# Altium project Pre-Amp.PrjPcb
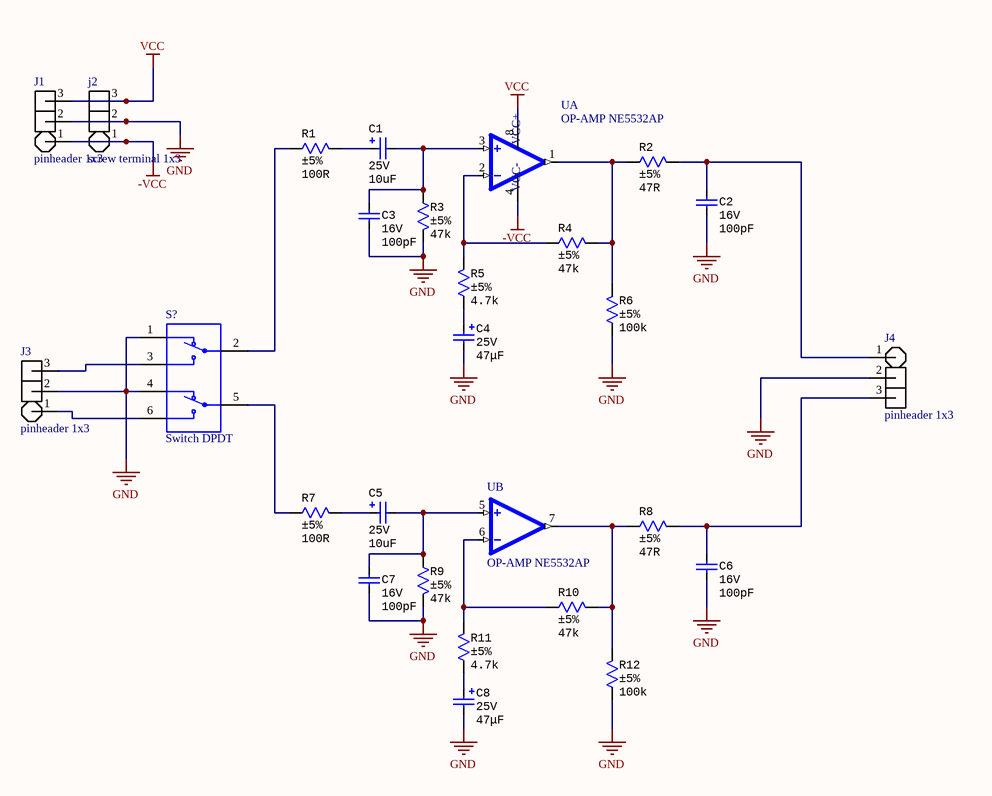
[diagram p0: Pre-Amp.SchDoc]
1 sheet, 26 parts. Net scope: global (net labels, ports and power ports of the same name join across sheets).
Board file: Pre-Amp.PcbDoc

## Sheet Pre-Amp.SchDoc
size A; SheetNumber: 1; SheetTotal: 1

### Parts
C1  value 10uF  Voltage: 25V  [CAP Electrolytic TH D5C2H11]
C2  value 100pF  Voltage: 16V  [Cap ceramic TH C025-024X044]
C3  value 100pF  Voltage: 16V  [Cap ceramic TH C025-024X044]
C4  value 47μF  Voltage: 25V  [CAP Electrolytic TH D6.3C2.5H11]
C5  value 10uF  Voltage: 25V  [CAP Electrolytic TH D5C2H11]
C6  value 100pF  Voltage: 16V  [Cap ceramic TH C025-024X044]
C7  value 100pF  Voltage: 16V  [Cap ceramic TH C025-024X044]
C8  value 47μF  Voltage: 25V  [CAP Electrolytic TH D6.3C2.5H11]
J1  pinheader 1x3  [Pin Header 1x3 TH Pitch 2.54mm]
j2  screw terminal 1x3  [screw terminal 1x3]
J3  pinheader 1x3  [Pin Header 1x3 TH Pitch 2.54mm]
J4  pinheader 1x3  [Pin Header 1x3 TH Pitch 2.54mm]
R1  value 100R  Tolerance: ±5%  [RES TH 0.25W H 0207$10]
R2  value 47R  Tolerance: ±5%  [RES TH 0.25W H 0207$10]
R3  value 47k  Tolerance: ±5%  [RES TH 0.25W H 0207$10]
R4  value 47k  Tolerance: ±5%  [RES TH 0.25W H 0207$10]
R5  value 4.7k  Tolerance: ±5%  [RES TH 0.25W H 0207$10]
R6  value 100k  Tolerance: ±5%  [RES TH 0.25W H 0207$10]
R7  value 100R  Tolerance: ±5%  [RES TH 0.25W H 0207$10]
R8  value 47R  Tolerance: ±5%  [RES TH 0.25W H 0207$10]
R9  value 47k  Tolerance: ±5%  [RES TH 0.25W H 0207$10]
R10  value 47k  Tolerance: ±5%  [RES TH 0.25W H 0207$10]
R11  value 4.7k  Tolerance: ±5%  [RES TH 0.25W H 0207$10]
R12  value 100k  Tolerance: ±5%  [RES TH 0.25W H 0207$10]
S?  Switch DPDT  [Switch latching spring DPDT]
U  OP-AMP NE5532AP  [IC DIP-8]  (parts A,B of 2)

### Nets
-VCC: J1.1 j2.1 U.4(VCC-)
GND: C2.2 C3.2 C4.2 C6.2 C7.2 C8.2 J1.2 j2.2 J3.2 J4.2 R3.2 R6.1 R9.2 R12.1 S?.1 S?.4
VCC: J1.3 j2.3 U.8(VCC+)
NetC1_1: C1.1 R1.2
NetC1_2: C1.2 C3.1 R3.1 U.3(1IN+)
NetC2_1: C2.1 J4.1 R2.2
NetC4_1: C4.1 R5.1
NetC5_1: C5.1 R7.2
NetC5_2: C5.2 C7.1 R9.1 U.5(2IN+)
NetC6_1: C6.1 J4.3 R8.2
NetC8_1: C8.1 R11.1
NetJ3_1: J3.1 S?.6
NetJ3_3: J3.3 S?.3
NetR1_1: R1.1 S?.2
NetR2_1: R2.1 R4.2 R6.2 U.1(1OUT)
NetR4_1: R4.1 R5.2 U.2(1IN-)
NetR7_1: R7.1 S?.5
NetR8_1: R8.1 R10.2 R12.2 U.7(2OUT)
NetR10_1: R10.1 R11.2 U.6(2IN-)

### Library data of the parts
C1 C5 = Capacitor Aluminium: Manufacturer: Wurth; PartNumber: 860080475013; ValueManufacturerPartNumber: Aluminium capacitor, 10uF, 25V, ±20%, 54mOhm, 14x10x5 mm, -55...+105°C; TypeCapacitor: Aluminium capacitor; Tolerance: ±20%; Impedance: 54mOhm; Package: 14x10x5 mm; HelpURL: https://www.digikey.com/product-detail/en/wurth-electronics-inc/860080475013/732-9029-1-ND/5728972; Temperature: -55...+105°C
C2 C3 C6 C7 = Capacitor Ceramic: Manufacturer: Yageo; PartNumber: CC0201KRX7R7BB103; ValueManufacturerPartNumber: Ceramic capacitor, 100pF, X7R, ±10%, 16V, 0201, -55...+125°C; TypeCapacitor: Ceramic capacitor; Tolerance: ±10%; TypeDielectric: X7R; Package: 0201; HelpURL: https://www.digikey.com/product-detail/en/yageo/CC0201KRX7R7BB103/311-1404-1-ND/2833710; Temperature: -55...+125°C
C4 C8 = Capacitor Aluminium: Manufacturer: Wurth; PartNumber: 860080475013; ValueManufacturerPartNumber: Aluminium capacitor, 47μF, 25V, ±20%, 54mOhm, 14x10x5 mm, -55...+105°C; TypeCapacitor: Aluminium capacitor; Tolerance: ±20%; Impedance: 54mOhm; Package: 14x10x5 mm; HelpURL: https://www.digikey.com/product-detail/en/wurth-electronics-inc/860080475013/732-9029-1-ND/5728972; Temperature: -55...+105°C
J1 J3 J4 = pinheader 1x3: SAMTEC - TSW-103-07-F-S - Pin Header, Unshrouded, Board-to-Board, 2.54 mm, 1 Rows, 3 Contacts, Through Hole, TSW Series; Number of Positions: 3; Connector Type: Male Pin; Gender: Male; Max Current Rating: 7.6A; Max Voltage Rating (AC): 550V; Pitch: 2.54mm; Supplier 1: Digi-Key; Manufacturer: Samtec; Manufacturer Part Number: TSW-103-07-F-S; RoHS: Yes; Category: Headers and Wire Housings; Stock 1: 23568; Pricing 1: 1=0.41000, 10=0.35000, 100=0.27220, 500=0.23332, 1000=0.19442, 5000=0.16665, 10000=0.15554 (USD); Mount: Through Hole; Contact Plating: Gold; Color: Black; Contact Material: Bronze; Housing Material: Polyester; Housing Color: Black; Min Operating Temperature: -55°C; Max Operating Temperature: 125°C; Number of Rows: 1; Packaging: Rail/Tube; Termination: Solder; Number of Contacts: 3; Package Quantity: 1; Orientation: Vertical; Series: TSW; Contact Type: Male Pin; Length: 7.62mm; Contact Mating Length: 0.23inch; Depth: 2.54mm; Radiation Hardening: No; REACH SVHC: No SVHC; RoHS Compliant: Yes; ComponentLink1URL: https://datasheet.ciiva.com/739/tsw-xxx-xx-xxx-x-xx-xxx-mkt-739892.pdf?src-supplier=Digi-Key; ComponentLink1Description: https://datasheet.ciiva.com/739/tsw-xxx-xx-xxx-x-xx-xxx-mkt-739892.pdf?src-supplier=Digi-Key; Supplier Part Number 1: SAM8995-ND
j2 = screw terminal 1x3: PCB Terminal Block 3 Poles, 5 mm Pitch, 691101710003, Würth Elektronik; Manufacturer: Wurth Electronics; Plating: Steel; Number of Levels: 1; Number of Positions Per Level: 3; Current: 16A; Voltage: 250V; Wire Gauge (Max): 26AWG; Wire Gauge (Min): 14AWG; Pitch: 0.197inch; Stripping Length: -7mm; Supplier 1: Digi-Key; Manufacturer Part Number: 691101710003; RoHS: Yes; Category: Terminal Blocks; Stock 1: 955; Pricing 1: 1=0.96000, 10=0.86200, 50=0.74500, 100=0.69120 (USD); Mount: Through Hole; Color: Blue; Housing Material: PA66; Contact Material: Brass; Contact Plating: Tin; Min Operating Temperature: -40°C; Max Operating Temperature: 105°C; Packaging: Bulk; Termination: Screw; Package Quantity: 400; Number of Contacts: 3; Series: WR-TBL Series 101; Voltage Rating: 250V; Current Rating: 16A; Length: 9mm; Width: 16.2mm; Height: 16.4mm; Wire/Cable Gauge: 26AWG; REACH SVHC: Unknown; RoHS Compliant: Yes; ComponentLink1URL: https://datasheet.ciiva.com/824/6911017100xx-824072.pdf?src-supplier=Digi-Key; ComponentLink1Description: https://datasheet.ciiva.com/824/6911017100xx-824072.pdf?src-supplier=Digi-Key; Supplier Part Number 1: 732-2027-ND
R1 R7 = Resistor Fixed: Manufacturer: Yageo; PartNumber: RC0201JR-07100RL; ValueManufacturerPartNumber: Resistor film, 100R, ±5%, 0201, 0.05W, -55...+125°C; TypeResistor: Resistor film; Power: 0.05W; Package: 0201; HelpURL: https://www.digikey.com/product-detail/en/yageo/RC0201JR-07100RL/311-100NCT-ND/1949006; Temperature: -55...+125°C
R2 R8 = Resistor Fixed: Manufacturer: Yageo; PartNumber: RC0201JR-07100RL; ValueManufacturerPartNumber: Resistor film, 47R, ±5%, 0201, 0.05W, -55...+125°C; TypeResistor: Resistor film; Power: 0.05W; Package: 0201; HelpURL: https://www.digikey.com/product-detail/en/yageo/RC0201JR-07100RL/311-100NCT-ND/1949006; Temperature: -55...+125°C
R3 R4 R9 R10 = Resistor Fixed: Manufacturer: Yageo; PartNumber: RC0201JR-07100RL; ValueManufacturerPartNumber: Resistor film, 47k, ±5%, 0201, 0.05W, -55...+125°C; TypeResistor: Resistor film; Power: 0.05W; Package: 0201; HelpURL: https://www.digikey.com/product-detail/en/yageo/RC0201JR-07100RL/311-100NCT-ND/1949006; Temperature: -55...+125°C
R5 R11 = Resistor Fixed: Manufacturer: Yageo; PartNumber: RC0201JR-07100RL; ValueManufacturerPartNumber: Resistor film, 4.7k, ±5%, 0201, 0.05W, -55...+125°C; TypeResistor: Resistor film; Power: 0.05W; Package: 0201; HelpURL: https://www.digikey.com/product-detail/en/yageo/RC0201JR-07100RL/311-100NCT-ND/1949006; Temperature: -55...+125°C
R6 R12 = Resistor Fixed: Manufacturer: Yageo; PartNumber: RC0201JR-07100RL; ValueManufacturerPartNumber: Resistor film, 100k, ±5%, 0201, 0.05W, -55...+125°C; TypeResistor: Resistor film; Power: 0.05W; Package: 0201; HelpURL: https://www.digikey.com/product-detail/en/yageo/RC0201JR-07100RL/311-100NCT-ND/1949006; Temperature: -55...+125°C
S? = Switch DPDT: Switch Toggle ON ON DPDT Long Baton Lever PC Pins 20VAC 20VDC 0.4VA PC Mount with Threads; MP: 2267077-2; MF: TE Connectivity; EU_RoHS_Compliance: Compliant with Exemptions; Package: TO-94 TE Connectivity; Availability: Unavailable; Price: None; SnapEDA_Link: https://www.snapeda.com/parts/2267077-2/TE%20Connectivity%20ALCOSWITCH%20Switches/view-part/2377537/?ref=snap; Value: *
U = OP-AMP NE5532AP: General Purpose Amplifier 2 Circuit 8-PDIP; MF: Texas Instruments; Price: None; Package: PDIP-8 Texas Instruments; Availability: Unavailable; SnapEDA_Link: https://www.snapeda.com/parts/NE5532AP/Texas%20Instruments/view-part/9041/?ref=snap; Value: *; MP: NE5532AP